# Altium schematic sheet mboard_pwr_fuse.SchDoc: =GlobalProjectName
size 209 x 297 mm; SheetNumber: 17; SheetTotal: 17; PageSetup: Record=PageOptions|CenterHorizontal=True|CenterVertical=True|PrintScale=1.00|XCorrection=1.00|YCorrection=1.00|PrintKind=1|BorderSize=5000000|LeftOffset=0|BottomOffset=0|Orientation=2|PaperLength=1000|PaperWidth=1000|Scale=100|PaperSource=15|PrintQuality=1200|MediaType=1|DitherType=10|PaperKind=A3|PrintScaleMode=1; Weight: -; ScaleFactor: -
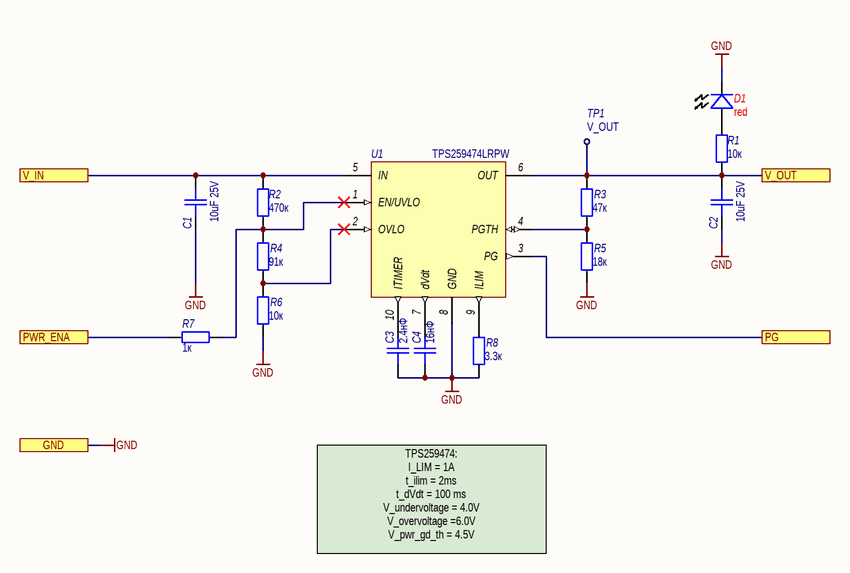
[diagram p0: mboard_pwr_fuse.SchDoc]

## Parts
D1  value red  [LED_0402_RED]  (hidden comment: LED)
R1  10к  [SMD_0603]
R2  470к  [SMD_0603]
R3  47к  [SMD_0603]
R4  91к  [SMD_0603]
R5  18к  [SMD_0603]
R6  10к  [SMD_0603]
R7  1к  [SMD_0603]
R8  3.3к  [SMD_0603]
TP1  V_OUT  [TestPoint]
U1  Наименование: TPS259474LRPW  [VQFN-HR-10]  (hidden comment: TPS25947x)
С1  10uF 25V  [SMD_C0603]
С2  10uF 25V  [SMD_C0603]
С3  2.4нФ  [SMD_C0603]
С4  16нФ  [SMD_C0603]

## Ports
GND, PG, PWR_ENA, V_IN, V_OUT

## Nets
GND: D1.2(K) R5.1 R6.1 R8.1 U1.8(GND) С1.1 С2.1 С3.1 С4.1 ; port GND
PG: U1.3(PG) ; port PG
PWR_ENA: R7.R? ; port PWR_ENA
V_IN: R2.2 U1.5(IN) С1.2 ; port V_IN
V_OUT: R1.2 R3.2 TP1.0(TP) U1.6(OUT) С2.2 ; port V_OUT
NetD1_1: D1.1(A) R1.1
NetR2_1: R2.1 R4.2 R7.1 U1.1(EN/UVLO)
NetR3_1: R3.1 R5.2 U1.4(PGTH)
NetR4_1: R4.1 R6.2 U1.2(OVLO)
NetR8_2: R8.2 U1.9(ILIM)
NetU1_7: U1.7(dVdt) С4.2
NetU1_10: U1.10(ITIMER) С3.2

## Notes on the sheet
- TPS259474:
  I_LIM = 1A
  t_ilim = 2ms
  t_dVdt = 100 ms
  V_undervoltage = 4.0V
  V_overvoltage =6.0V
  V_pwr_gd_th = 4.5V
- Подп. и дата
- Инв. № дубл.
- Взам. инв. №
- Инв. № подл.
- Изм.
- Лист
- № докум.
- Подп.
- Дата
- Форма 2а ГОСТ 2.104-2006
- Копировал
- Формат А4

## Library data of the parts
D1 = LED: Назначение: LED 0402 red; Наименование: SMD-LED; Потребление, Вт: 0,01
R1-R8 = Resistor: Наименование: Резистор; Назначение: SMD-резистор; Потребление, Вт: 0,001
  R1 R6: Value: 10к
  R2: Value: 470к
  R3: Value: 47к
  R4: Value: 91к
  R5: Value: 18к
  R7: Value: 1к
  R8: Value: 3.3к
TP1 = TP: Наименование: Точка проверки; Назначение: Контроль параметров платы; TP_Name: V_OUT
U1 = TPS25947x: TPS25947xx, 2.7 - 23 V, 5.5 A, 28-mΩ True Reverse Current Blocking eFuse with Input / Reverse Polarity Protection; Потребление, Вт: 0,05; Назначение: 2.7 - 23 V, 5.5 A, 28-mΩ True Reverse Current Blocking eFuse with Input; ComponentLink1Description: DataSheet; ComponentLink1URL: https://www.ti.com/lit/ds/symlink/tps25947.pdf?ts=1621925066842&ref_url=https%253A%252F%252Fwww.ti.com%252Fproduct%252FTPS25947%253FkeyMatch%253DTPS25947%2526tisearch%253Dsearch-everything%2526usecase%253DGPN
С1 С2 = Capacitor: SMD 0603; Наименование: Конденсатор; Потребление, Вт: 0; Точность: 20%; Напряжение: 25В; Назначение: SMD 0603; Value: 10uF 25V
С3 С4 = Capacitor: Назначение: SMD-конденсатор; Наименование: Конденсатор; Потребление, Вт: 0; Точность: %; Напряжение: В; Диэлектрик: *
  С3: Value: 2.4нФ
  С4: Value: 16нФ